# Altium schematic sheet BMP388.SchDoc
size A4
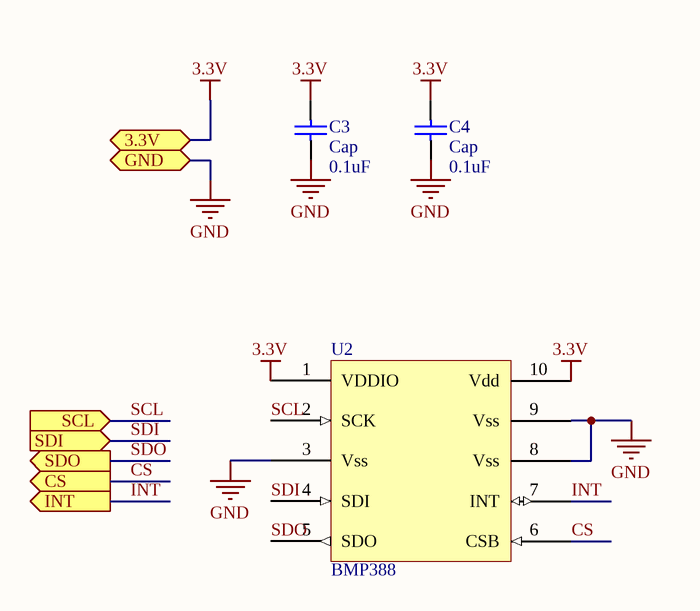
[diagram p0: BMP388.SchDoc]

## Parts
C3  Cap  value 0.1uF  [0603]
C4  Cap  value 0.1uF  [0603]
U2  BMP388  [BMP388]

## Ports
3.3V, CS (out), GND, INT (out), SCL (in), SDI (in), SDO (out)

## Nets
3.3V: C3.1 C4.1 U2.1(VDDIO) U2.10(Vdd) ; port 3.3V
GND: C3.2 C4.2 U2.3(Vss) U2.8(Vss) U2.9(Vss) ; port GND
CS: U2.6(CSB) ; port CS
INT: U2.7(INT) ; port INT
SCL: U2.2(SCK) ; port SCL
SDI: U2.4(SDI) ; port SDI
SDO: U2.5(SDO) ; port SDO

## Library data of the parts
C3 C4 = Cap: Capacitor; Published: 8-Jun-2000; LatestRevisionDate: 17-Jul-2002; LatestRevisionNote: Re-released for DXP Platform.; PackageReference: RAD-0.3; Publisher: Altium Limited; PackageDescription: Radial Cap, Thru-Hole; 2 Leads; 0.3 in Pin Spacing